# Altium schematic sheet Placa.SchDoc
size A4
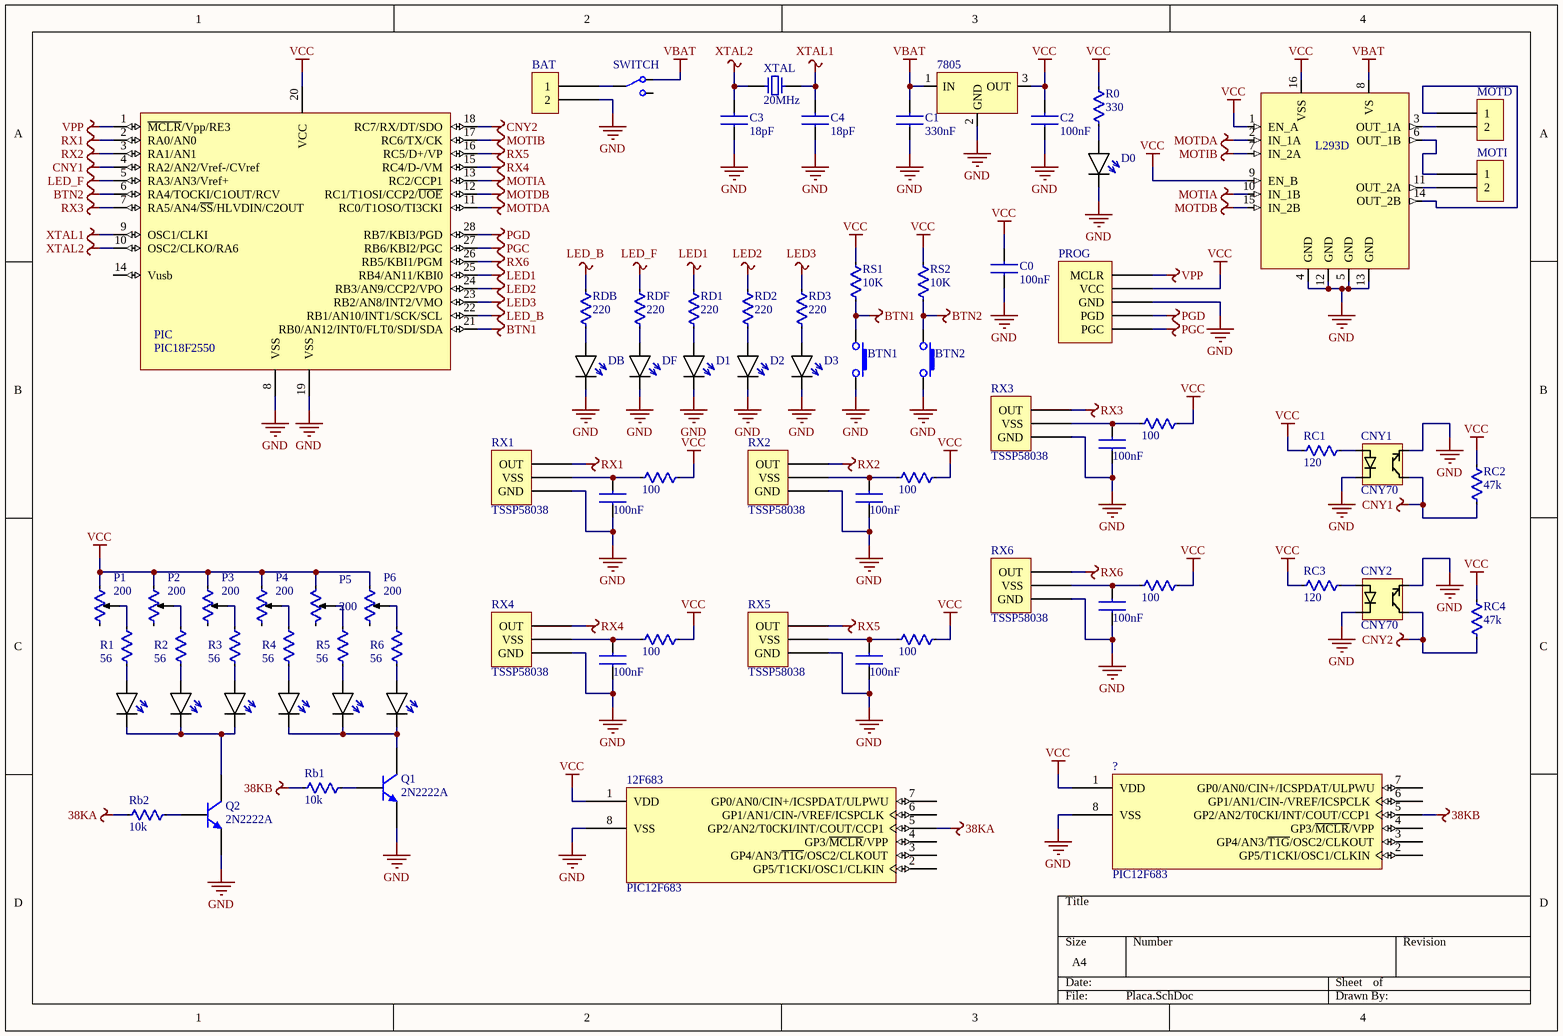
[diagram p0: Placa.SchDoc]

## Parts
12F683  PIC12F683  [PDIP300-P8]
7805  LM78XX  [TO-220-STRAIGHT]  (value not drawn)
?  PIC12F683  [PDIP300-P8]
BAT  Header 1x2  [HEADER 1x2]  (value not drawn)
BTN1  BUTTON_SMALL_4PIN  [TACT_SWITCH-SMALL-4PIN]  (value not drawn)
BTN2  BUTTON_SMALL_4PIN  [TACT_SWITCH-SMALL-4PIN]  (value not drawn)
C0  value 100nF  [CAP-CER]  (hidden comment: CAP-CER)
C1  value 330nF  [CAP-CER]  (hidden comment: CAP-CER)
C2  value 100nF  [CAP-CER]  (hidden comment: CAP-CER)
C3  value 18pF  [CAP-CER]  (hidden comment: CAP-CER)
C4  value 18pF  [CAP-CER]  (hidden comment: CAP-CER)
CNY1  CNY70  [CNY70]
CNY2  CNY70  [CNY70]
CR1  value 100nF  [CAP-CER]
CR2  value 100nF  [CAP-CER]
CR3  value 100nF  [CAP-CER]
CR4  value 100nF  [CAP-CER]
CR5  value 100nF  [CAP-CER]
CR6  value 100nF  [CAP-CER]
D0  LED  [LED-3MM-RED]  (value not drawn)
D1  LED  [LED-3MM-RED]  (value not drawn)
D2  LED  [LED-3MM-YELLOW]  (value not drawn)
D3  LED  [LED-3MM-GREEN]  (value not drawn)
DB  LED  [LED-3MM-GREEN]  (value not drawn)
DF  LED  [LED-3MM-GREEN]  (value not drawn)
L293D  L293  [DIP16]  (value not drawn)
MOTD  (no value)  [HEADER 1x2]
MOTI  (no value)  [HEADER 1x2]
P1  value 200  [POT-10TURN]
P2  value 200  [POT-10TURN]
P3  value 200  [POT-10TURN]
P4  value 200  [POT-10TURN]
P5  value 200  [POT-10TURN]
P6  value 200  [POT-10TURN]
PIC  PIC18F2550  [DIP28]
PROG  (no value)  [Header 1x5]
Q1  2N2222A  [TO-92]
Q2  2N2222A  [TO-92]
R0  value 330  [RES-Axial-400mil]  (hidden comment: RES)
R1  value 56  [RES-Axial-400mil]
R2  value 56  [RES-Axial-400mil]
R3  value 56  [RES-Axial-400mil]
R4  value 56  [RES-Axial-400mil]
R5  value 56  [RES-Axial-400mil]
R6  value 56  [RES-Axial-400mil]
Rb1  value 10k  [RES-Axial-400mil]
Rb2  value 10k  [RES-Axial-400mil]
RC1  value 120  [RES-Axial-400mil]  (hidden comment: RES)
RC2  value 47k  [RES-Axial-400mil]  (hidden comment: RES)
RC3  value 120  [RES-Axial-400mil]  (hidden comment: RES)
RC4  value 47k  [RES-Axial-400mil]  (hidden comment: RES)
RD1  value 220  [RES-Axial-400mil]  (hidden comment: RES)
RD2  value 220  [RES-Axial-400mil]  (hidden comment: RES)
RD3  value 220  [RES-Axial-400mil]  (hidden comment: RES)
RDB  value 220  [RES-Axial-400mil]  (hidden comment: RES)
RDF  value 220  [RES-Axial-400mil]  (hidden comment: RES)
RR1  value 100  [RES-Axial-400mil]  (hidden comment: RES)
RR2  value 100  [RES-Axial-400mil]  (hidden comment: RES)
RR3  value 100  [RES-Axial-400mil]  (hidden comment: RES)
RR4  value 100  [RES-Axial-400mil]  (hidden comment: RES)
RR5  value 100  [RES-Axial-400mil]  (hidden comment: RES)
RR6  value 100  [RES-Axial-400mil]  (hidden comment: RES)
RS1  value 10K  [RES-Axial-400mil]  (hidden comment: RES)
RS2  value 10K  [RES-Axial-400mil]  (hidden comment: RES)
RX1  TSSP58038  [Header 1x3]
RX2  TSSP58038  [Header 1x3]
RX3  TSSP58038  [Header 1x3]
RX4  TSSP58038  [Header 1x3]
RX5  TSSP58038  [Header 1x3]
RX6  TSSP58038  [Header 1x3]
SWITCH  SLIDE-SWITCH  [SWITCH]  (value not drawn)
TX1  LED  [LED-3MM-YELLOW]  (value not drawn)
TX2  LED  [LED-3MM-YELLOW]  (value not drawn)
TX3  LED  [LED-3MM-YELLOW]  (value not drawn)
TX4  LED  [LED-3MM-YELLOW]  (value not drawn)
TX5  LED  [LED-3MM-YELLOW]  (value not drawn)
TX6  LED  [LED-3MM-YELLOW]  (value not drawn)
XTAL  FREQUENCY: 20MHz  [HC-49/S]  (hidden comment: XTAL)

## Nets
38KA: 12F683.5(GP2/AN2/T0CKI/INT/COUT/CCP1) Rb2.1
38KB: ?.5(GP2/AN2/T0CKI/INT/COUT/CCP1) Rb1.1
BTN1: BTN1.1 PIC.21(RB0/AN12/INT0/FLT0/SDI/SDA) RS1.1
BTN2: BTN2.1 PIC.6(RA4/TOCKI/C1OUT/RCV) RS2.1
CNY1: CNY1.C PIC.4(RA2/AN2/Vref-/CVref) RC2.1
CNY2: CNY2.C PIC.18(RC7/RX/DT/SDO) RC4.1
GND: 12F683.8(VSS) 7805.2(GND) ?.8(VSS) BAT.2 BTN1.2 BTN2.2 C0.1 C1.1 C2.1 C3.1 C4.1 CNY1.E(7.5) CNY1.K CNY2.E(7.5) CNY2.K CR1.1 CR2.1 CR3.1 CR4.1 CR5.1 CR6.1 D0.K D1.K D2.K D3.K DB.K DF.K L293D.4(GND) L293D.5(GND) L293D.12(GND) L293D.13(GND) PIC.8(VSS) PIC.19(VSS) PROG.3(GND) Q1.E Q2.E RX1.2(GND) RX2.2(GND) RX3.2(GND) RX4.2(GND) RX5.2(GND) RX6.2(GND)
LED1: PIC.25(RB4/AN11/KBI0) RD1.1
LED2: PIC.24(RB3/AN9/CCP2/VPO) RD2.1
LED3: PIC.23(RB2/AN8/INT2/VMO) RD3.1
LED_B: PIC.22(RB1/AN10/INT1/SCK/SCL) RDB.1
LED_F: PIC.5(RA3/AN3/Vref+) RDF.1
MOTDA: L293D.2(IN_1A) PIC.11(RC0/T1OSO/TI3CKI)
MOTDB: L293D.15(IN_2B) PIC.12(RC1/T1OSI/CCP2/~{UOE})
MOTIA: L293D.10(IN_1B) PIC.13(RC2/CCP1)
MOTIB: L293D.7(IN_2A) PIC.17(RC6/TX/CK)
PGC: PIC.27(RB6/KBI2/PGC) PROG.5(PGC)
PGD: PIC.28(RB7/KBI3/PGD) PROG.4(PGD)
RX1: PIC.2(RA0/AN0) RX1.1(OUT)
RX2: PIC.3(RA1/AN1) RX2.1(OUT)
RX3: PIC.7(RA5/AN4/~{SS}/HLVDIN/C2OUT) RX3.1(OUT)
RX4: PIC.15(RC4/D-/VM) RX4.1(OUT)
RX5: PIC.16(RC5/D+/VP) RX5.1(OUT)
RX6: PIC.26(RB5/KBI1/PGM) RX6.1(OUT)
VBAT: 7805.1(IN) C1.2 L293D.8(VS) SWITCH.1
VCC: 12F683.1(VDD) 7805.3(OUT) ?.1(VDD) C0.2 C2.2 L293D.1(EN_A) L293D.9(EN_B) L293D.16(VSS) P1.1 P2.1 P3.1 P4.1 P5.3 P6.1 PIC.20(VCC) PROG.2(VCC) R0.2 RC1.1 RC2.2 RC3.1 RC4.2 RR1.2 RR2.2 RR3.2 RR4.2 RR5.2 RR6.2 RS1.2 RS2.2
VPP: PIC.1(~{MCLR}/Vpp/RE3) PROG.1(MCLR)
XTAL1: C4.2 PIC.9(OSC1/CLKI) XTAL.2
XTAL2: C3.2 PIC.10(OSC2/CLKO/RA6) XTAL.1
NetBAT_1: BAT.1 SWITCH.2
NetCNY1_A: CNY1.A RC1.2
NetCNY2_A: CNY2.A RC3.2
NetCR1_2: CR1.2 RR1.1 RX1.3(VSS)
NetCR2_2: CR2.2 RR2.1 RX2.3(VSS)
NetCR3_2: CR3.2 RR3.1 RX3.3(VSS)
NetCR4_2: CR4.2 RR4.1 RX4.3(VSS)
NetCR5_2: CR5.2 RR5.1 RX5.3(VSS)
NetCR6_2: CR6.2 RR6.1 RX6.3(VSS)
NetD0_A: D0.A R0.1
NetD1_A: D1.A RD1.2
NetD2_A: D2.A RD2.2
NetD3_A: D3.A RD3.2
NetDB_A: DB.A RDB.2
NetDF_A: DF.A RDF.2
NetL293D_3: L293D.3(OUT_1A) MOTD.2
NetL293D_6: L293D.6(OUT_1B) MOTI.1
NetL293D_11: L293D.11(OUT_2A) MOTI.2
NetL293D_14: L293D.14(OUT_2B) MOTD.1
NetP1_2: P1.2 R1.2
NetP2_2: P2.2 R2.2
NetP3_2: P3.2 R3.2
NetP4_2: P4.2 R4.2
NetP5_2: P5.2 R5.2
NetP6_2: P6.2 R6.2
NetQ1_B: Q1.B Rb1.2
NetQ1_C: Q1.C TX4.K TX5.K TX6.K
NetQ2_B: Q2.B Rb2.2
NetQ2_C: Q2.C TX1.K TX2.K TX3.K
NetR1_1: R1.1 TX1.A
NetR2_1: R2.1 TX2.A
NetR3_1: R3.1 TX3.A
NetR4_1: R4.1 TX4.A
NetR5_1: R5.1 TX5.A
NetR6_1: R6.1 TX6.A

Not connected (* = marked no-connect by the designer): 12F683 2(GP5/T1CKI/OSC1/CLKIN) 3(GP4/AN3/~{T1G}/OSC2/CLKOUT) 4(GP3/~{MCLR}/VPP) 6(GP1/AN1/CIN-/VREF/ICSPCLK) 7(GP0/AN0/CIN+/ICSPDAT/ULPWU); ? 2(GP5/T1CKI/OSC1/CLKIN) 3(GP4/AN3/~{T1G}/OSC2/CLKOUT) 4(GP3/~{MCLR}/VPP) 6(GP1/AN1/CIN-/VREF/ICSPCLK) 7(GP0/AN0/CIN+/ICSPDAT/ULPWU); P1 3; P2 3; P3 3; P4 3; P5 1; P6 3; PIC 14(Vusb); SWITCH 3

## Library data of the parts
CR1-CR6 = CAP-CER
MOTD MOTI = Header 1x2
P1-P6 = POT
PROG = Header Programmer
Q1 Q2 = NPN
R1-R6 Rb1 Rb2 = RES